# Altium schematic sheet MB_Power.SchDoc
size 420 x 297 mm; Date: 18/12/2022; ApprovedBy: UA3REO; CheckedBy: UA3REO; Author: RU4PN; CompanyName: Wolf Team; DocumentNumber: Wolf2 MainBoard Power; SheetNumber: 3; SheetTotal: 7
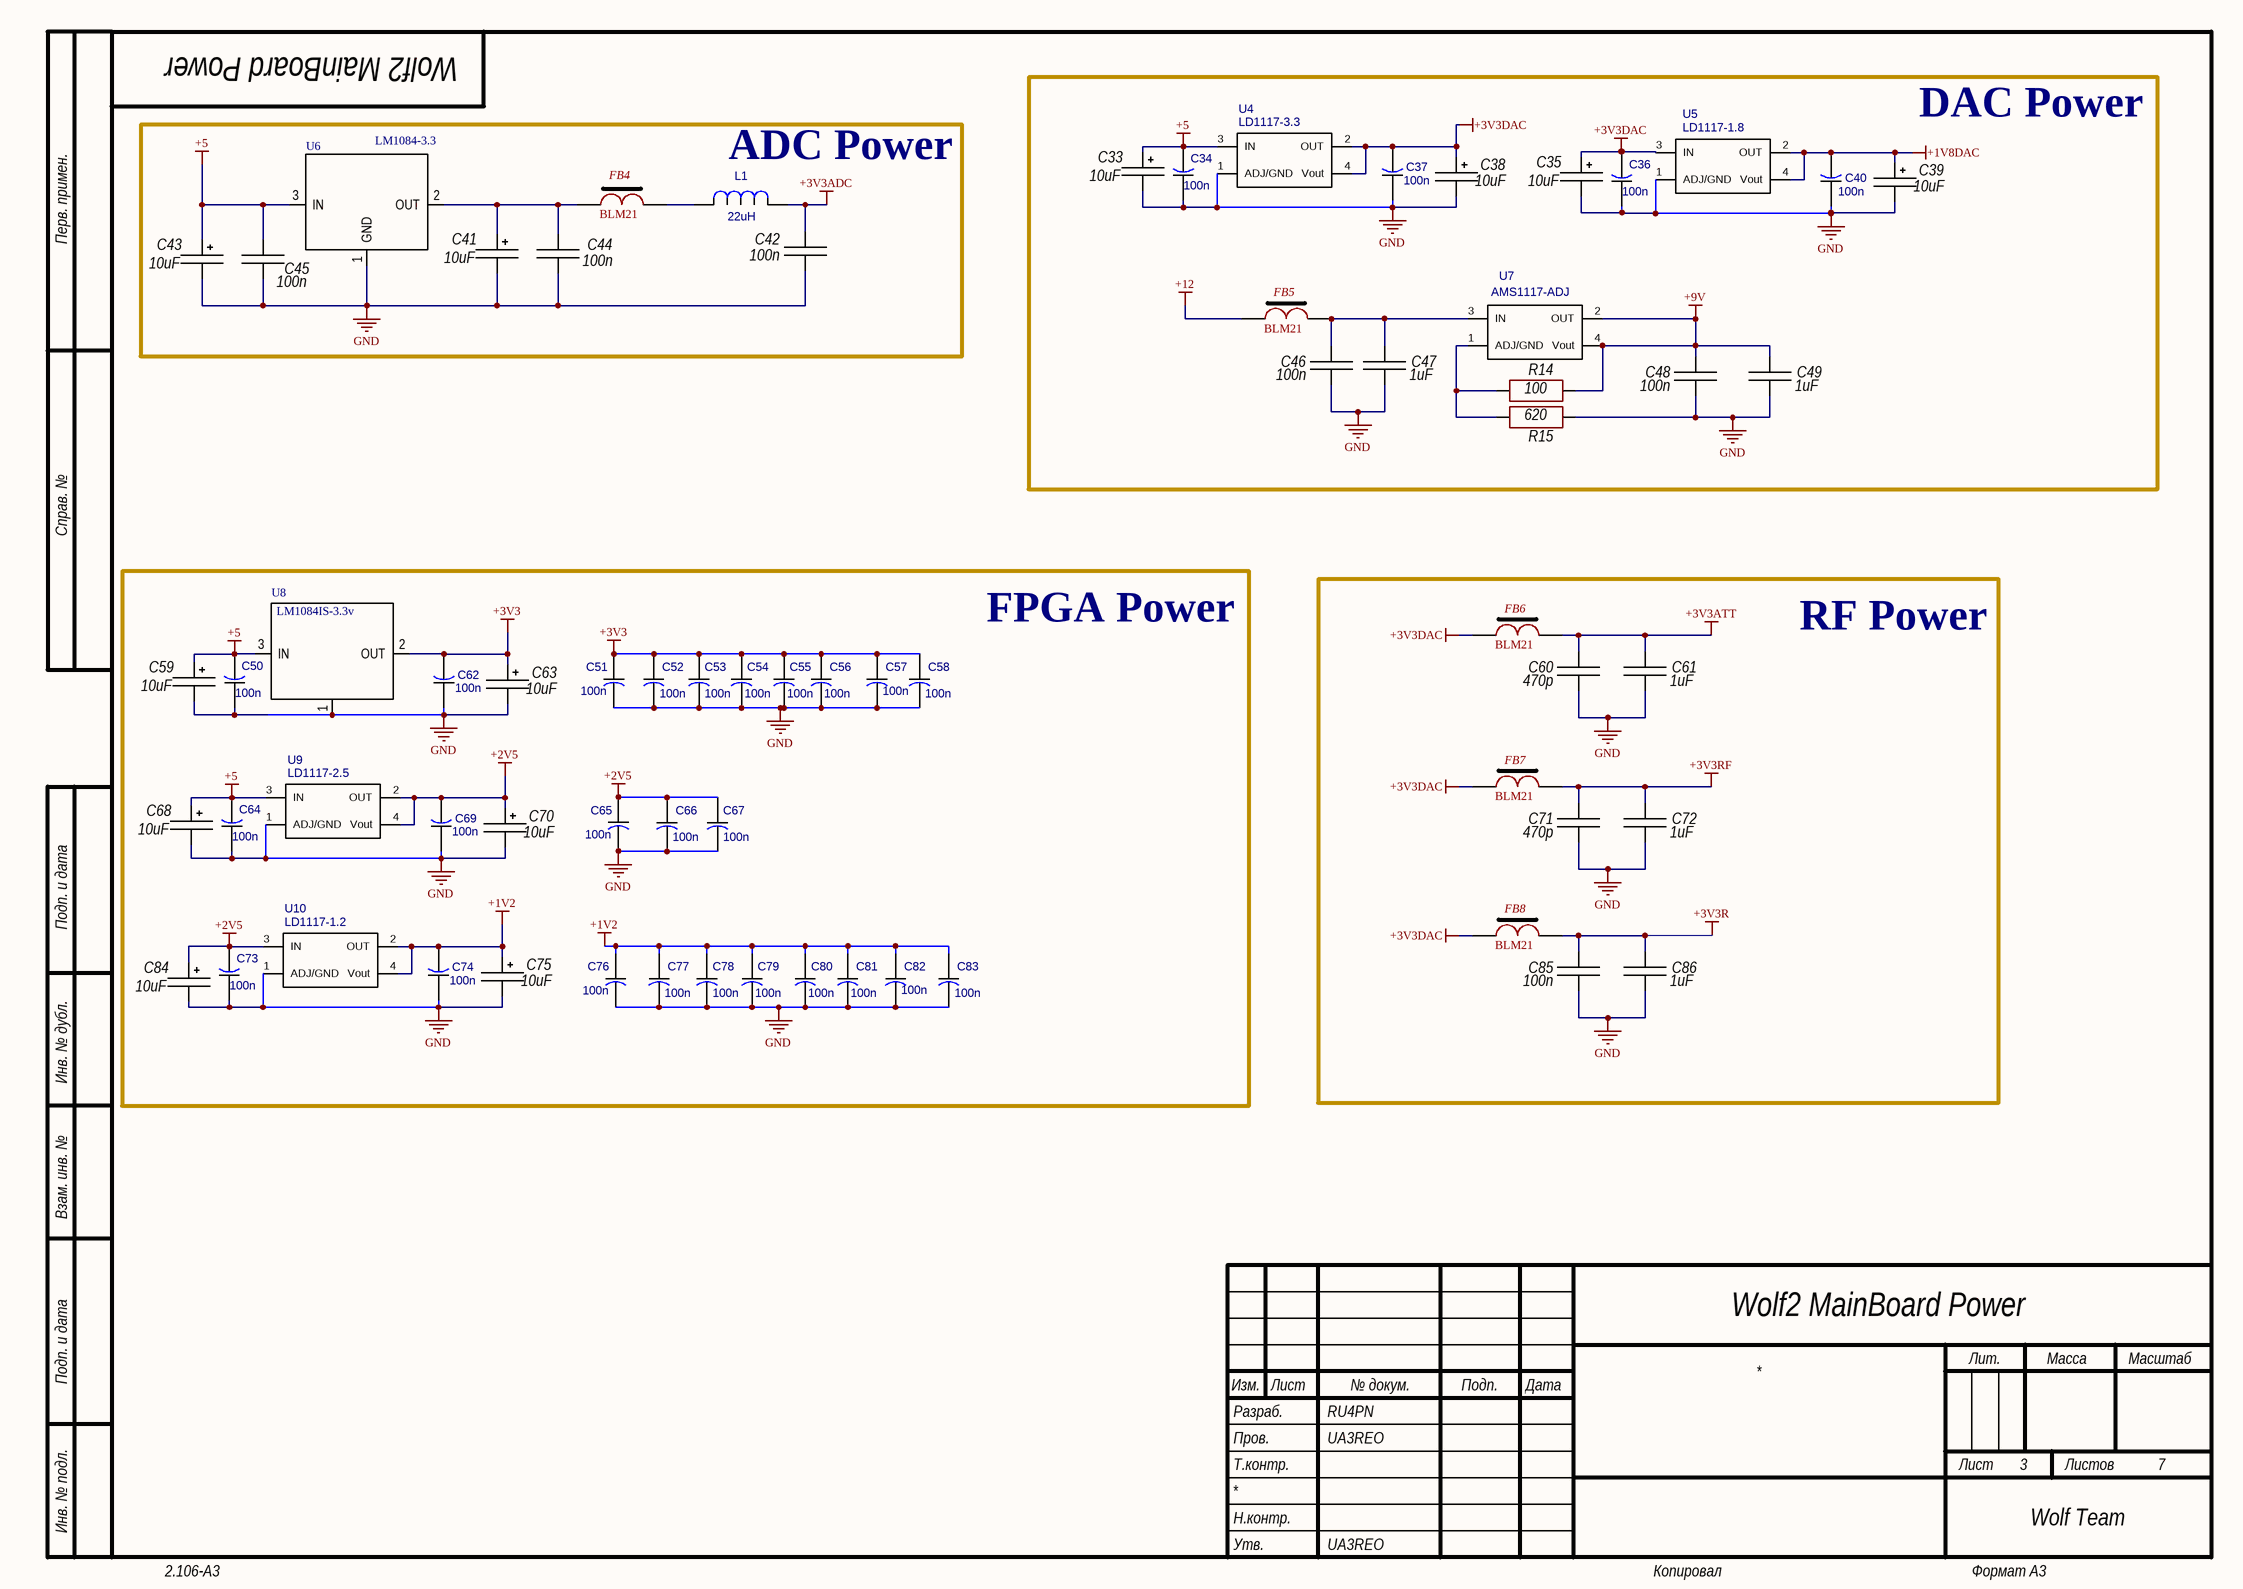
[diagram p0: MB_Power.SchDoc]

## Parts
C33  10uF  [TANTAL_B]
C34  100n  [CAP_0805]
C35  10uF  [TANTAL_B]
C36  100n  [CAP_0805]
C37  100n  [CAP_0805]
C38  10uF  [TANTAL_B]
C39  10uF  [TANTAL_B]
C40  100n  [CAP_0805]
C41  10uF  [TANTAL_B]
C42  100n  [CH0805C]
C43  10uF  [TANTAL_B]
C44  100n  [CH0805C]
C45  100n  [CH0805C]
C46  100n  [CH0805C]
C47  1uF  [CH0805C]
C48  100n  [CH0805C]
C49  1uF  [CH0805C]
C50  100n  [CAP_0805]
C51  100n  [CH0805C]
C52  100n  [CH0805C]
C53  100n  [CH0805C]
C54  100n  [CH0805C]
C55  100n  [CH0805C]
C56  100n  [CH0805C]
C57  100n  [CH0805C]
C58  100n  [CH0805C]
C59  10uF  [TANTAL_B]
C60  470p  [CH0805C]
C61  1uF  [CH0805C]
C62  100n  [CAP_0805]
C63  10uF  [TANTAL_B]
C64  100n  [CAP_0805]
C65  100n  [CH0805C]
C66  100n  [CH0805C]
C67  100n  [CH0805C]
C68  10uF  [TANTAL_B]
C69  100n  [CAP_0805]
C70  10uF  [TANTAL_B]
C71  470p  [CH0805C]
C72  1uF  [CH0805C]
C73  100n  [CAP_0805]
C74  100n  [CAP_0805]
C75  10uF  [TANTAL_B]
C76  100n  [CH0805C]
C77  100n  [CH0805C]
C78  100n  [CH0805C]
C79  100n  [CH0805C]
C80  100n  [CH0805C]
C81  100n  [CH0805C]
C82  100n  [CH0805C]
C83  100n  [CH0805C]
C84  10uF  [TANTAL_B]
C85  100n  [CH0805C]
C86  1uF  [CH0805C]
FB4  BLM21  [CH0805L]
FB5  BLM21  [CH0805L]
FB6  BLM21  [CH0805L]
FB7  BLM21  [CH0805L]
FB8  BLM21  [CH0805L]
L1  22uH  [IND_7x7]
R14  100  [CH0805R]
R15  620  [CH0805R]
U4  value LD1117-3.3  [LT1117CST-3.3_2]  (hidden comment: 1117-3.3)
U5  value LD1117-1.8  [LT1117CST-3.3]  (hidden comment: 1117-1.8)
U6  LM1084-3.3  [LM1084-3.3]
U7  value AMS1117-ADJ  [LT1117CST-3.3]  (hidden comment: 1117-ADJ)
U8  LM1084IS-3.3v  [LM1084-3.3]
U9  value LD1117-2.5  [LT1117CST-3.3_2]  (hidden comment: 1117-2.5)
U10  value LD1117-1.2  [LT1117CST-3.3_2]  (hidden comment: 1117-1.2)

## Blocks framed on the sheet
DAC Power: C33-C40 C46-C49 FB5 R14 R15 U4 U5 U7
ADC Power: C41-C45 FB4 L1 U6
FPGA Power: C50-C59 C62-C70 C73-C84 U8-U10
RF Power: C60 C61 C71 C72 C85 C86 FB6-FB8

## Nets
+1V2: C74.2 C75.1 C76.1 C77.1 C78.1 C79.1 C80.1 C81.1 C82.1 C83.1 U10.2(OUT) U10.4(Vout)
+1V8DAC: C39.1 C40.2 U5.2(OUT) U5.4(Vout)
+2V5: C65.1 C66.1 C67.1 C69.2 C70.1 C73.2 C84.1 U9.2(OUT) U9.4(Vout) U10.3(IN)
+3V3: C51.1 C52.1 C53.1 C54.1 C55.1 C56.1 C57.1 C58.1 C62.2 C63.1 U8.2(OUT)
+3V3ADC: C42.1 L1.2
+3V3ATT: C60.1 C61.1 FB6.1
+3V3DAC: C35.1 C36.2 C37.2 C38.1 FB6.2 FB7.2 FB8.2 U4.2(OUT) U4.4(Vout) U5.3(IN)
+3V3R: C85.1 C86.1 FB8.1
+3V3RF: C71.1 C72.1 FB7.1
+5: C33.1 C34.2 C43.1 C45.1 C50.2 C59.1 C64.2 C68.1 U4.3(IN) U6.3(IN) U8.3(IN) U9.3(IN)
+9V: C48.1 C49.1 R14.1 U7.2(OUT) U7.4(Vout)
+12: FB5.2
GND: C33.2 C34.1 C35.2 C36.1 C37.1 C38.2 C39.2 C40.1 C41.2 C42.2 C43.2 C44.2 C45.2 C46.2 C47.2 C48.2 C49.2 C50.1 C51.2 C52.2 C53.2 C54.2 C55.2 C56.2 C57.2 C58.2 C59.2 C60.2 C61.2 C62.1 C63.2 C64.1 C65.2 C66.2 C67.2 C68.2 C69.1 C70.2 C71.2 C72.2 C73.1 C74.1 C75.2 C76.2 C77.2 C78.2 C79.2 C80.2 C81.2 C82.2 C83.2 C84.2 C85.2 C86.2 R15.1 U4.1(ADJ/GND) U5.1(ADJ/GND) U6.1(GND) U8.1 U9.1(ADJ/GND) U10.1(ADJ/GND)
NetC41_1: C41.1 C44.1 FB4.2 U6.2(OUT)
NetC46_1: C46.1 C47.1 FB5.1 U7.3(IN)
NetFB4_1: FB4.1 L1.1
NetR14_2: R14.2 R15.2 U7.1(ADJ/GND)

## Notes on the sheet
- Перв. примен.
- Справ. №
- Подп. и дата
- Инв. № дубл.
- Взам. инв. №
- Разраб.
- Изм.
- Лист
- № докум.
- Подп.
- Дата
- Лит.
- Масса
- Масштаб
- Пров.
- Т.контр.
- Листов
- Инв. № подл.
- Утв.
- Н.контр.
- 2.106-A3
- Копировал
- Формат А3

## Library data of the parts
C33 C35 C38 C39 C41 C43 C59 C63 C68 C70 C75 C84 = TantalCap: Manufacturer: *; Model: *; HelpURL: *; ComponentKind: *; Value: *
C34 C36 C37 C40 C50-C58 C62 C64-C67 C69 C73 C74 C76-C83 = CAP_0805: Value: 100n
C42 C44-C49 C60 C61 C71 C72 C85 C86 = Capacitor: Manufacturer: *; Model: *; HelpURL: *; ComponentKind: *; Value: *
FB4-FB8 = FB-1
L1 = IND_1206
R14 R15 = Resistor: Manufacturer: *; Model: *; HelpURL: *; ComponentKind: *; Value: *
U4 = LT1117CST-3.3
U5 = LT1117CST-3.3: LT1117CST-1.8
U6 U8 = LM1084
U7 = LT1117CST-3.3: LT1117CST-ADJ
U9 = LT1117CST-3.3: LT1117CST-2.5
U10 = LT1117CST-3.3: LT1117CST-1.2